# EAGLE design Memory_Card (EAGLE 9.2.0)
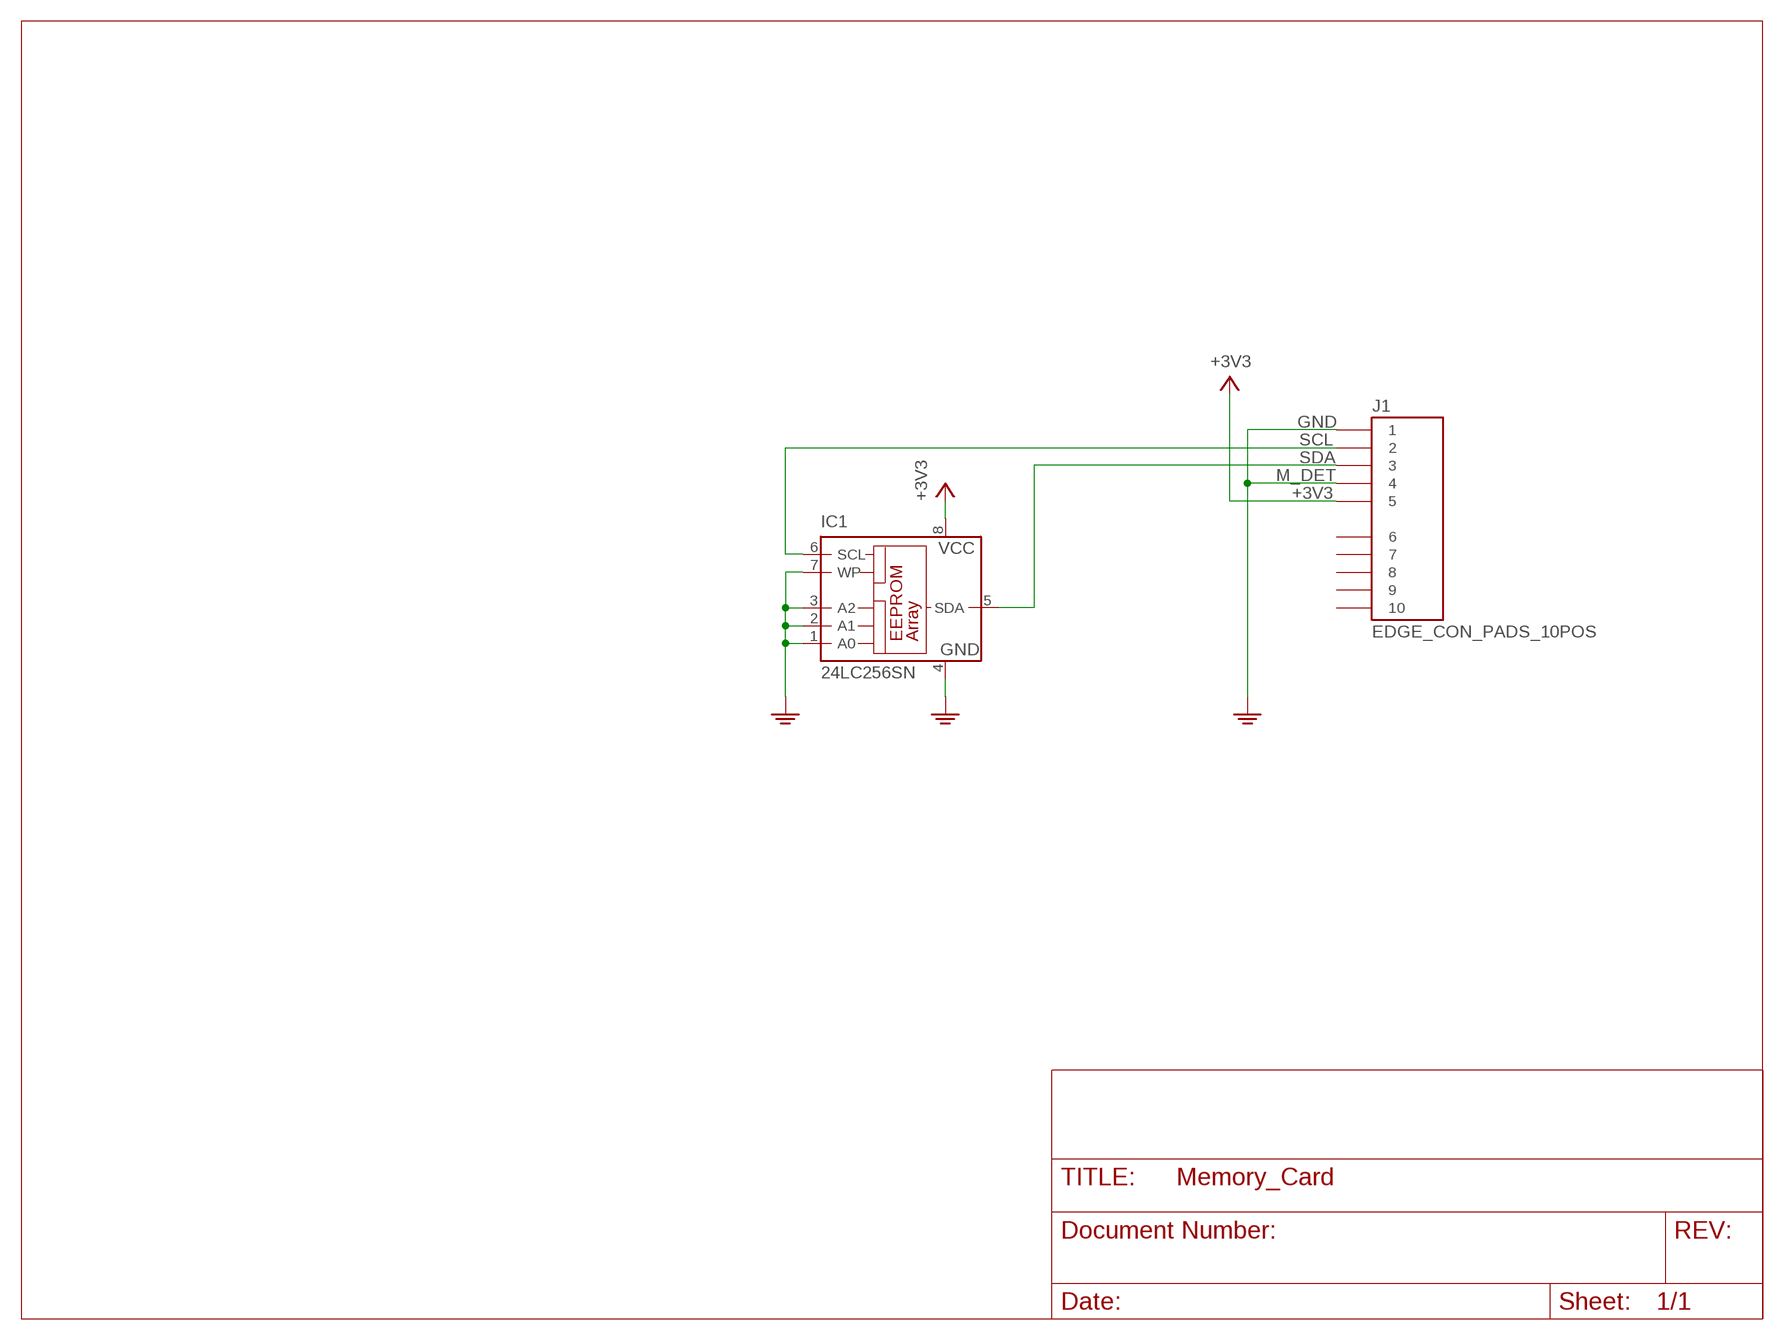
[diagram p0: schematic, sheet 1]

## Parts
IC1  24LC256SN  [SO-08]
J1  EDGE_CON_PADS_10POS  [EDGE_CON_PADS]

## Nets
+3V3: IC1.8(VCC) J1.5
GND: IC1.1(A0) IC1.2(A1) IC1.3(A2) IC1.4(GND) IC1.7(WP) J1.1 J1.4
SCL: IC1.6(SCL) J1.2
SDA: IC1.5(SDA) J1.3
Unconnected: J1.6 J1.7 J1.8 J1.9 J1.10

## Notes on the sheet
- M_DET

## Library data of the parts
IC1 = microchip:24*: Serial EEPROM I2C; MF: MICROCHIP; MPN: 24LC256-I/SN; OC_FARNELL: 9757996; OC_NEWARK: 27C9144
J1 = xavier:EDGE_CON_PADS_10POS: 44 PIN EDGE CONNECTOR FOR PCB

## Board
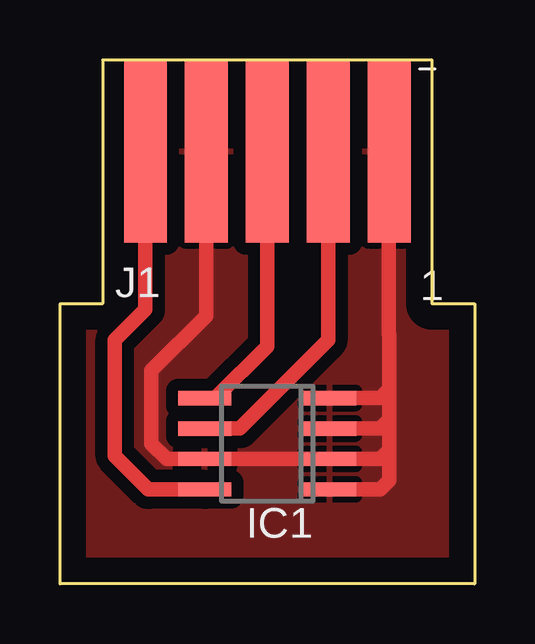
[diagram p1: board, top side]
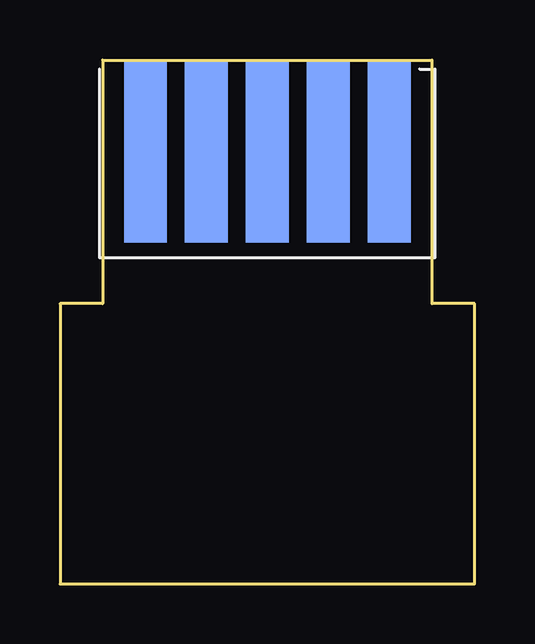
[diagram p2: board, bottom side, seen from below]

Size 17.27 x 21.84 mm. Coordinates in mm from the lower left corner, seen from the top.
Outline: 15.49,11.68 17.27,11.68 17.27,0 0,0 0,11.68 1.78,11.68 1.78,21.84 15.49,21.84 15.49,11.68
Copper layers (1*16): Top 0.035mm / dielectric 1.5mm / Bottom 0.035mm
Design rules "DRCmasse": minimum track width 20mil, minimum drill 1mil, track to track 20mil, track to pad 50mil, pad to pad 10mil, via to via 10mil, smd to smd 8mil, copper to edge 40mil, drill to drill 8mil, minimum pad ring 10mil, minimum via ring 8mil, stop-mask expansion 0mil, vias tented up to drill 0mil, thermal gap 10mil

### Footprints (pad centres in the part's own frame; a part is rotated, then mirrored left to right if it is on the bottom)
SO-08 = smd 0.6 x 2.2: 1 -1.905,-2.6; 2 -0.635,-2.6; 3 0.635,-2.6; 4 1.905,-2.6; 5 1.905,2.6; 6 0.635,2.6; 7 -0.635,2.6; 8 -1.905,2.6
EDGE_CON_PADS = smd 1.778 x 7.62: 1 5.08,-3.81; 2 2.54,-3.81; 3 0,-3.81; 4 -2.54,-3.81; 5 -5.08,-3.81 | smd 1.778 x 7.62 bottom: 6 5.08,-3.81; 7 2.54,-3.81; 8 0,-3.81; 9 -2.54,-3.81; 10 -5.08,-3.81

### Placement (x,y rotation side)
IC1  8.64,5.84 90 top
J1  8.64,21.84 0 top

### Tracks (layer width: path | path; a pad name or v marks a point on that pad's centre or on a via)
+3V3
  Top 0.61: IC1.8 3.68,3.94 2.29,5.33 2.29,10.16 3.56,11.43 J1.5
GND
  Top 0.61: IC1.1 13.34,3.94 13.72,4.32 13.72,5.59 | 13.72,6.86 13.72,5.59 | 13.72,8.13 13.72,6.86 | 13.72,5.59 13.34,5.21 IC1.2 IC1.7 4.45,5.21 3.81,5.84 3.81,8.89 6.1,11.18 J1.4 | IC1.3 13.34,6.48 13.72,6.86 | IC1.4 13.34,7.75 13.72,8.13 | 13.72,8.13 13.72,10.4 13.71,10.41 13.71,18.02 J1.1
  pour Top: -2.54,23.88 19.56,23.88 19.56,-2.29 -2.54,-2.29
SCL
  Top 0.61: J1.2 11.18,10.16 7.49,6.48 IC1.6
SDA
  Top 0.61: IC1.5 6.48,7.75 8.64,9.91 J1.3